# EAGLE design nizal (EAGLE 7.6.0)
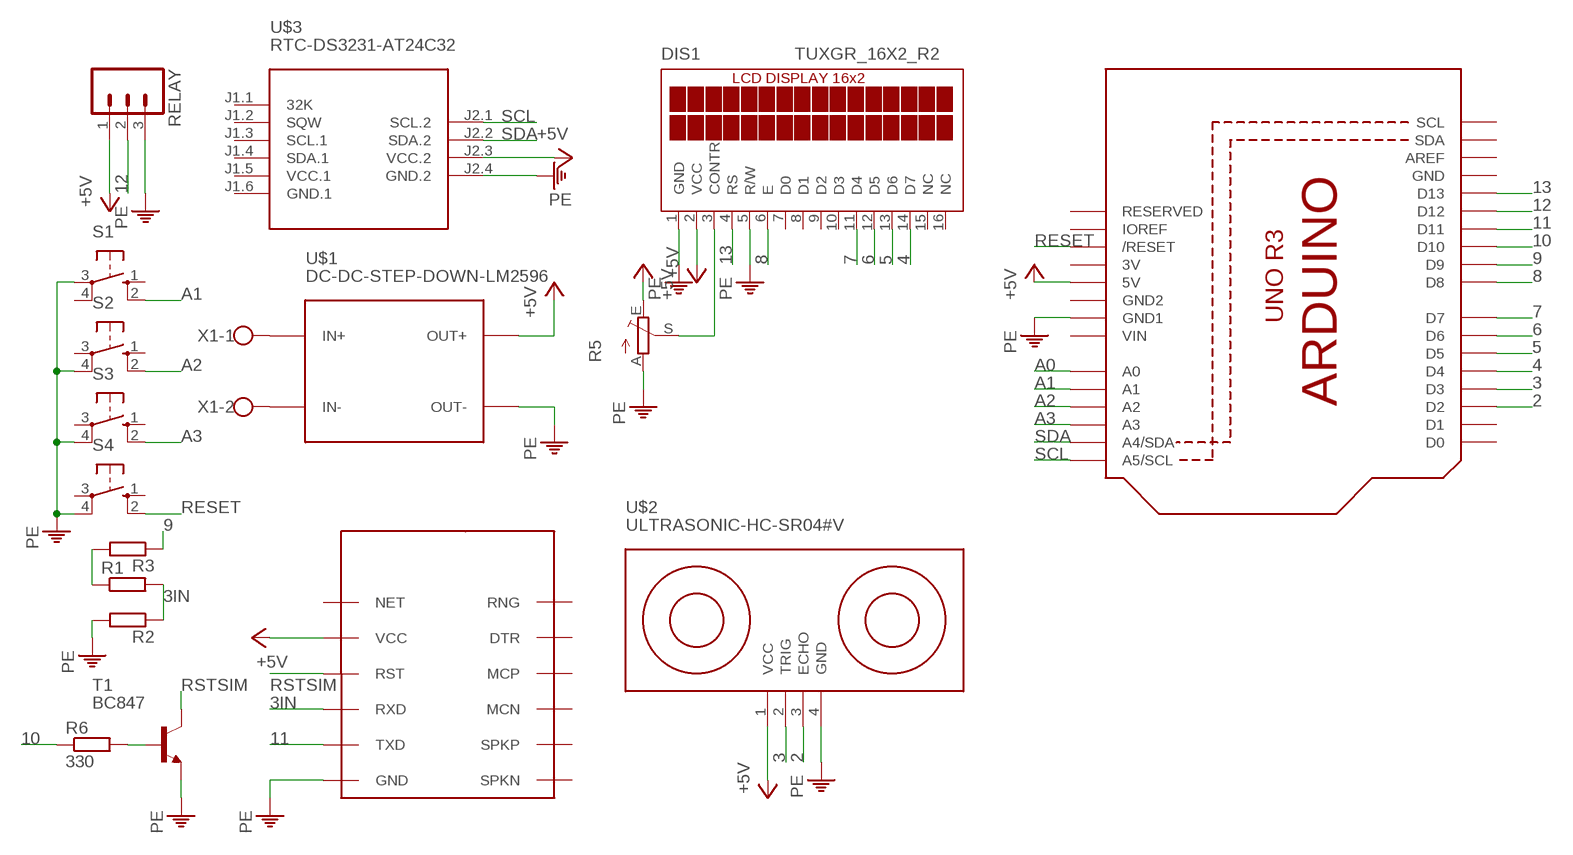
[diagram p0: schematic, sheet 1]

## Parts
DIS1  TUXGR_16X2_R2  [TUXGR_16X2_R2]
R1  R-EU_M0805  [M0805]
R2  R-EU_M0805  [M0805]
R3  R-EU_M0805  [M0805]
R5  TRIM_EU-CA6V  [CA6V]
R6  330  R-EU_M0805  [M0805]
RELAY  M03  [03P]
S1  10-XX  [B3F-10XX]
S2  10-XX  [B3F-10XX]
S3  10-XX  [B3F-10XX]
S4  10-XX  [B3F-10XX]
T1  BC847  [SOT23]
U1  ARDUINOR3-DIMENSION  [ARDUINOR3]
U$1  DC-DC-STEP-DOWN-LM2596  [DC-DC-STEP-DOWN-LM2596]
U$2  ULTRASONIC-HC-SR04#V  [ULTRASONIC-HC-SR04#V]
U$3  RTC-DS3231-AT24C32  [RTC-DS3231-AT24C32]
U$4  SIM800L  [SIM-CORE]
X1  W237-102  [W237-102]

## Nets
2: U1.D2 U$2.3(ECHO)
3: U1.D3 U$2.2(TRIG)
3IN: R1.2 R2.1 U$4.RXD
4: DIS1.14(D7) U1.D4
5: DIS1.13(D6) U1.D5
6: DIS1.12(D5) U1.D6
7: DIS1.11(D4) U1.D7
8: DIS1.6(E) U1.D8
9: R3.1 U1.D9
10: R6.1 U1.D10
11: U1.D11 U$4.TXD
12: RELAY.2 U1.D12
13: DIS1.4(RS) U1.D13
+5V: DIS1.2(VCC) R5.E RELAY.1 U1.5V U$1.OUT+ U$2.1(VCC) U$3.J2.3(VCC.2) U$4.VCC
A0: U1.A0
A1: S1.2(S1) U1.A1
A2: S2.2(S1) U1.A2
A3: S3.2(S1) U1.A3
N$1: U$1.IN+ X1.1
N$2: U$1.IN- X1.2
N$4: R6.2 T1.1(B)
N$6: R1.1 R3.2
N$11: DIS1.3(CONTR) R5.S
PE: DIS1.1(GND) DIS1.5(R/W) R2.2 R5.A RELAY.3 S1.3(P) S2.4(P1) S3.4(P1) S4.4(P1) T1.2(E) U1.GND1 U$1.OUT- U$2.4(GND) U$3.J2.4(GND.2) U$4.GND
RESET: S4.2(S1) U1.RESET(/RESET)
RSTSIM: T1.3(C) U$4.RST
SCL: U1.A5(A5/SCL) U$3.J2.1(SCL.2)
SDA: U1.A4(A4/SDA) U$3.J2.2(SDA.2)
Unconnected: DIS1.7(D0) DIS1.8(D1) DIS1.9(D2) DIS1.10(D3) DIS1.15(NC) DIS1.16(NC) S1.1(S) S1.4(P1) S2.1(S) S2.3(P) S3.1(S) S3.3(P) S4.1(S) S4.3(P) U1.AREF U1.D0 U1.D1 U1.IOREF U1.RESERVED U1.SCL U1.SDA U$3.J1.1(32K) U$3.J1.2(SQW) U$3.J1.3(SCL.1) U$3.J1.4(SDA.1) U$4.DTR U$4.MCN U$4.MCP U$4.NET U$4.RNG U$4.SPKN U$4.SPKP

## Power pins joined to a net without a drawn wire
3V: U1.3V
GND: U1.GND
GND2: U1.GND2
GND.1: U$3.J1.6(GND.1)
VCC.1: U$3.J1.5(VCC.1)
VIN: U1.VIN

## Library data of the parts
DIS1 = display-lcd:TUXGR_16X2_R2: Tuxgraphics LCD display 16x2 characters reflective, without background light Source: tuxgr_12x2_r2.pdf; OC_FARNELL: unknown; OC_NEWARK: unknown
R1-R3 R6 = rcl:R-EU_: RESISTOR, European symbol
R5 = pot:TRIM_EU-: POTENTIOMETER
RELAY = con-amp-quick:M03: AMP QUICK CONNECTOR; OC_FARNELL: unknown; OC_NEWARK: unknown
S1-S4 = switch-omron:10-XX: OMRON SWITCH; MPN: B3F-1000; OC_FARNELL: 176432; OC_NEWARK: 36M3542
T1 = transistor:BC847: NPN TRANSISTOR
U1 = microbuilder:ARDUINOR3: This is a new object for the new Arduino R3 - with extra pins that you may want to use (such as IOref, and duplicated A4/A5
U$1 = zmpt:DC-DC-STEP-DOWN-LM2596: DC/DC Step-Down Regulator based on LM2596-ADJ chip LM2596 datasheet available here: http://www.ti.com/lit/ds/symlink/lm2596.pdf Click here to find device on ebay.com <http://www.ebay.com/sch/lm2596+power+regulator>
U$2 = diy-modules:ULTRASONIC-HC-SR04: Ultrasonic Ranging Module HC-SR04 More details available here: http://randomnerdtutorials.com/complete-guide-for-ultrasonic-sensor-hc-sr04/ Click here to find device on ebay.com <http://www.ebay.com/sch/hc+sr04+ultrasonic>
U$3 = diy-modules:RTC-DS3231-AT24C32: RTC Module with Battery and EEPROM based on DS3231 and AT24C32 chips Tutorial can be found here: https://edwardmallon.wordpress.com/2014/05/21/using-a-cheap-3-ds3231-rtc-at24c32-eeprom-from-ebay/ Click here to find device on ebay.com <http://www.ebay.com/sch/DS3231+AT24C32+module>
U$4 = sim800l:SIM800L
X1 = con-wago-500:W237-102: WAGO SCREW CLAMP; MPN: 237-102; OC_FARNELL: unknown; OC_NEWARK: 70K9898

## Net classes
0 default: width 0.457 mm, drill 0.457 mm, clearance 0.457 mm

## Board
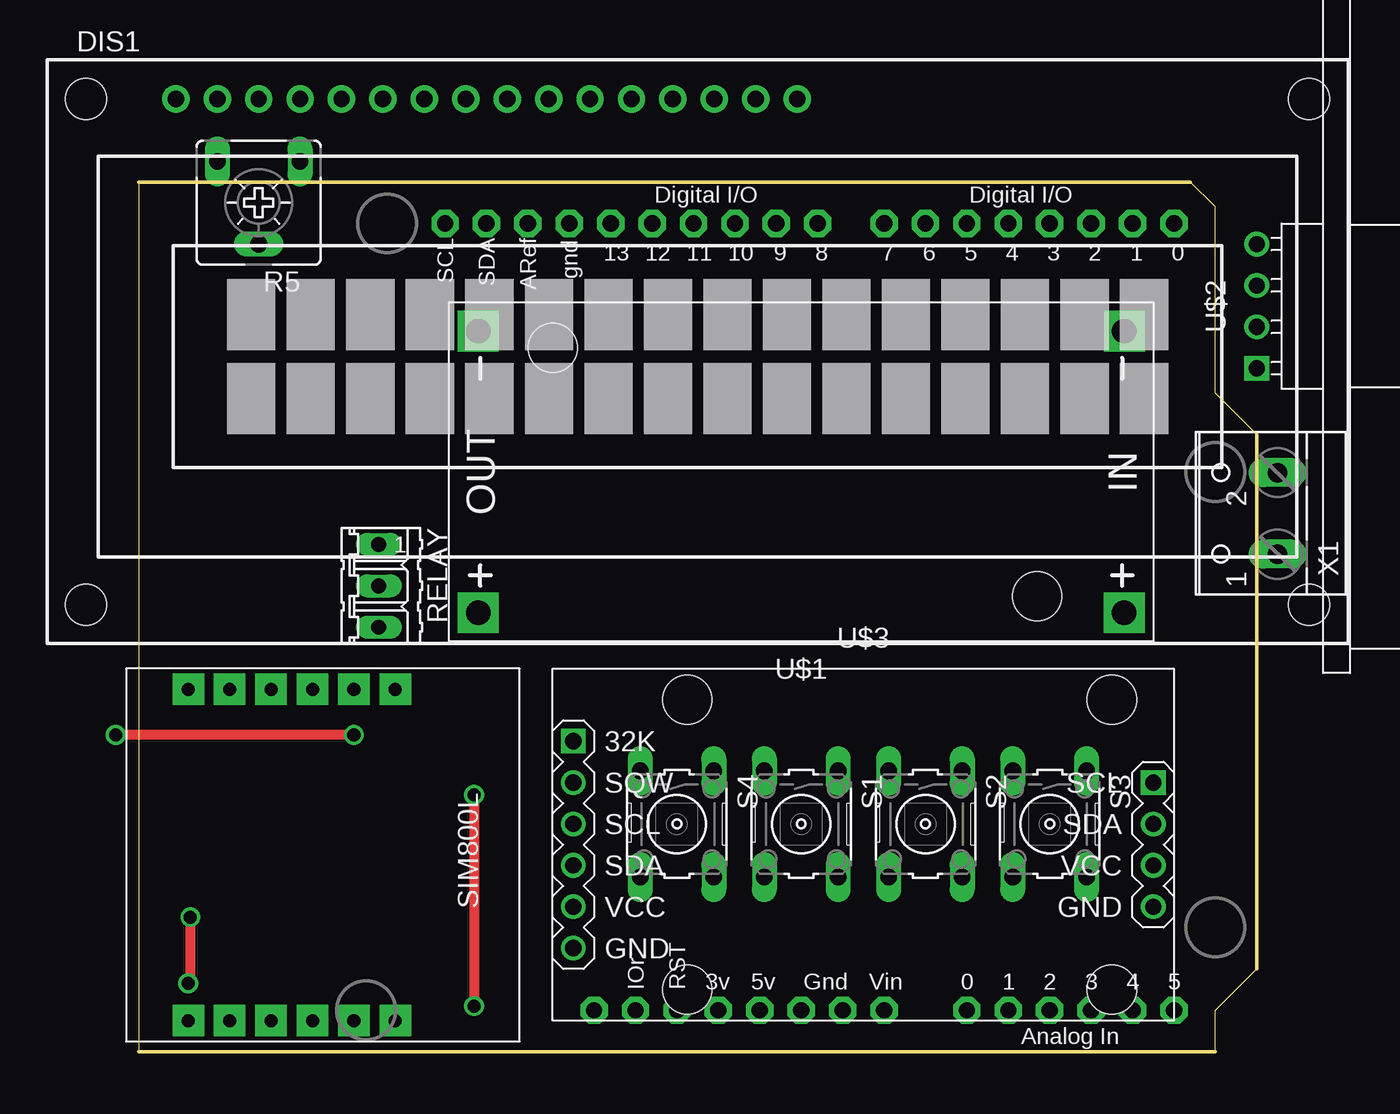
[diagram p1: board, top side]
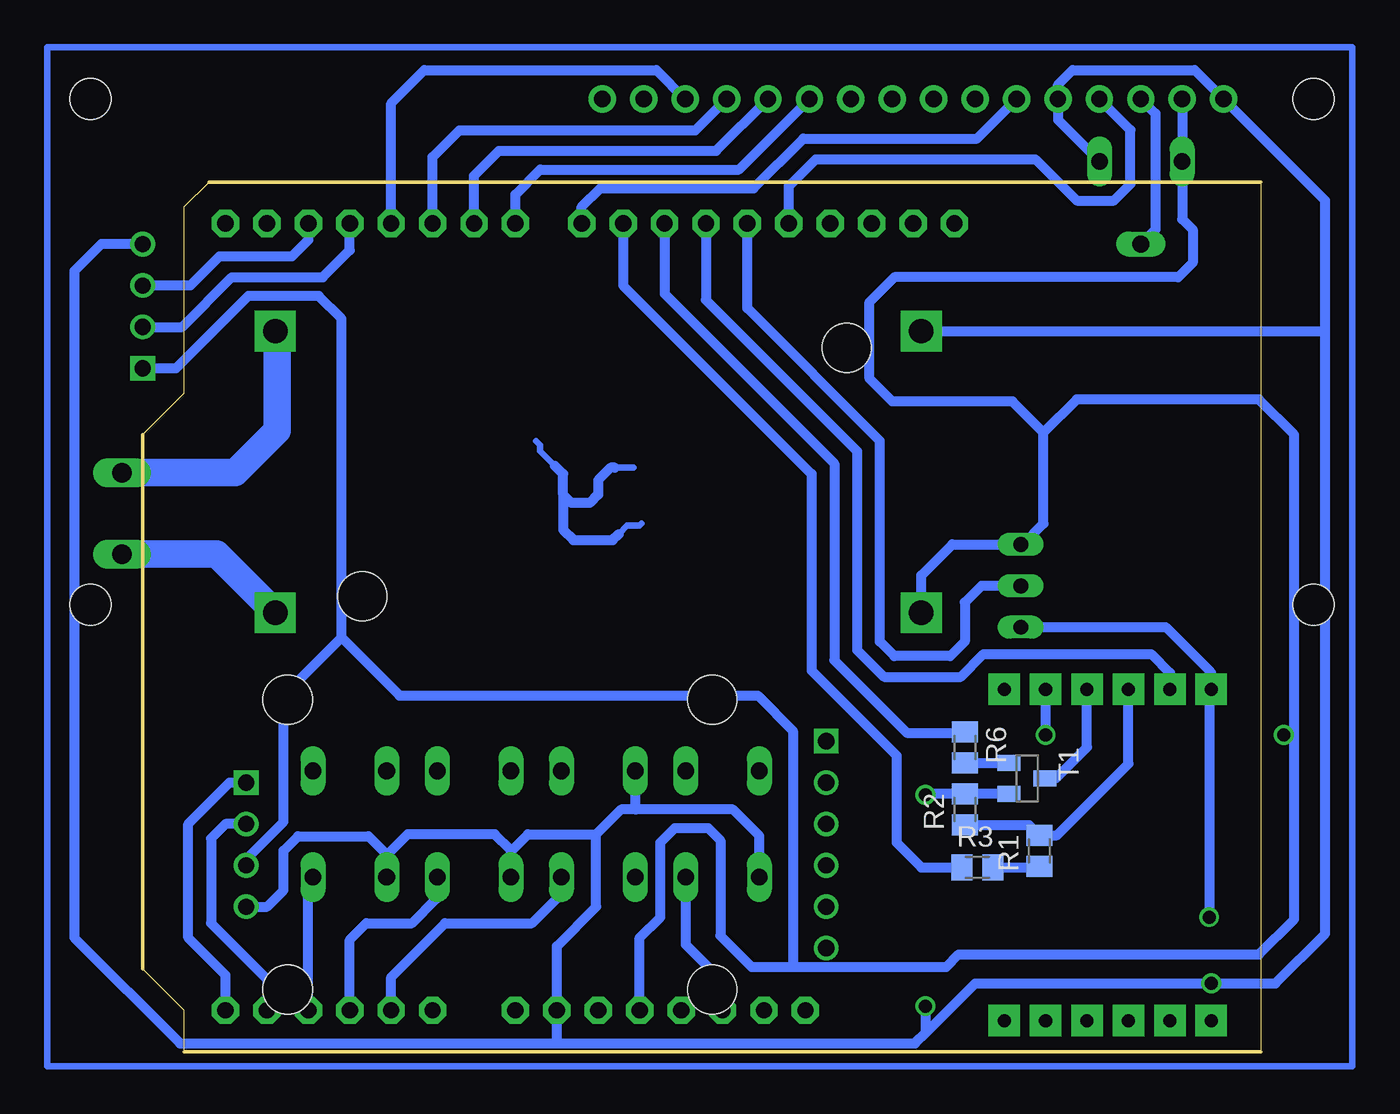
[diagram p2: board, bottom side, seen from below]

Size 68.58 x 53.34 mm. Coordinates in mm from the lower left corner, seen from the top.
Copper layers (1*16): Top 0.035mm / dielectric 1.5mm / Bottom 0.035mm
Design rules "default": minimum track width 10mil, minimum drill 24mil, track to track 8mil, track to pad 8mil, pad to pad 8mil, via to via 8mil, smd to smd 8mil, copper to edge 40mil, drill to drill 8mil, minimum pad ring 10mil, minimum via ring 8mil, stop-mask expansion 4mil, vias tented up to drill 0mil, thermal gap 10mil

### Footprints (pad centres in the part's own frame; a part is rotated, then mirrored left to right if it is on the bottom)
TUXGR_16X2_R2 = drill 1 pad 1.676: 1 -32,15.5; 2 -29.46,15.5; 3 -26.92,15.5; 4 -24.38,15.5; 5 -21.84,15.5; 6 -19.3,15.5; 7 -16.76,15.5; 8 -14.22,15.5; 9 -11.68,15.5; 10 -9.14,15.5; 11 -6.6,15.5; 12 -4.06,15.5; 13 -1.52,15.5; 14 1.02,15.5; 15 3.56,15.5; 16 6.1,15.5 | hole 2.5: -37.5,-15.5; 37.5,-15.5; -37.5,15.5; 37.5,15.5
M0805 = smd 1.3 x 1.6: 1 -0.95,0; 2 0.95,0
CA6V = drill 1.016 long: A -2.54,-2.54; E 2.54,-2.54; S 0,2.54
03P = drill 0.914 long: 1 -2.54,0; 2 0,0; 3 2.54,0
B3F-10XX = drill 1.016 long: 1 -3.251,2.261; 2 3.251,2.261; 3 -3.251,-2.261; 4 3.251,-2.261
SOT23 = smd 1 x 1.4: 1 -0.95,-1.1; 2 0.95,-1.1; 3 0,1.1
ARDUINOR3 = drill 1 pad 1.676 octagon: 3V 35.56,2.54; 5V 38.1,2.54; A0 50.8,2.54; A1 53.34,2.54; A2 55.88,2.54; A3 58.42,2.54; A4 60.96,2.54; A5 63.5,2.54; AREF 23.876,50.8; D0 63.5,50.8; D1 60.96,50.8; D2 58.42,50.8; D3 55.88,50.8; D4 53.34,50.8; D5 50.8,50.8; D6 48.26,50.8; D7 45.72,50.8; D8 41.656,50.8; D9 39.116,50.8; D10 36.576,50.8; D11 34.036,50.8; D12 31.496,50.8; D13 28.956,50.8; GND 26.416,50.8; GND1 43.18,2.54; GND2 40.64,2.54; IOREF 30.48,2.54; RESERVED 27.94,2.54; RESET 33.02,2.54; SCL 18.796,50.8; SDA 21.336,50.8; VIN 45.72,2.54
DC-DC-STEP-DOWN-LM2596 = drill 1.5 pad 2.5 square: IN+ -19.812,8.636; IN- -19.812,-8.636; OUT+ 19.812,8.636; OUT- 19.812,-8.636 | hole 3: -14.478,7.62; 15.24,-7.62
ULTRASONIC-HC-SR04#V = drill 1 square: 1 -3.81,0 | drill 1: 2 -1.27,0; 3 1.27,0; 4 3.81,0
RTC-DS3231-AT24C32 = drill 1 square: J1.1 -17.78,6.35; J2.1 17.78,3.81 | drill 1: J1.2 -17.78,3.81; J1.3 -17.78,1.27; J1.4 -17.78,-1.27; J1.5 -17.78,-3.81; J1.6 -17.78,-6.35; J2.2 17.78,1.27; J2.3 17.78,-1.27; J2.4 17.78,-3.81 | hole 3: -10.795,-8.89; -10.795,8.89; 15.24,8.89; 15.24,-8.89
SIM-CORE = drill 0.8 pad 1.93 square: DTR 21.59,13.97; GND 1.27,3.81; MCN 21.59,8.89; MCP 21.59,11.43; NET 1.27,16.51; RNG 21.59,16.51; RST 1.27,11.43; RXD 1.27,8.89; SPKN 21.59,3.81; SPKP 21.59,6.35; TXD 1.27,6.35; VCC 1.27,13.97
W237-102 = drill 1.194 long: 1 -2.5,-1.27; 2 2.5,-1.27

### Placement (x,y rotation side)
DIS1  34.29,42.93 0 top
R1  13.59,12.32 90 bottom
R2  18.16,14.86 90 bottom
R3  17.4,11.3 0 bottom
R5  7.37,52.07 180 top
R6  18.16,18.67 270 bottom
RELAY  14.73,28.57 270 top
S1  40.64,13.97 270 top
S2  48.26,13.97 270 top
S3  55.88,13.97 270 top
S4  33.02,13.97 270 top
T1  14.35,16.76 270 bottom
U1  0,0 0 top
U$1  40.64,35.56 180 top
U$2  68.58,45.72 90 top
U$3  44.45,12.7 0 top
U$4  -0.76,23.5 270 top
X1  68.58,33.02 90 top

### Tracks (layer width: path | path; a pad name or v marks a point on that pad's centre or on a via)
2
  Bottom 0.61: U1.D2 58.42,49.78 59.44,48.77 63.88,48.77 65.66,46.99 U$2.3
3
  Bottom 0.61: U$2.2 66.17,44.45 63.12,47.5 57.53,47.5 55.88,49.15 U1.D3
3IN
  Bottom 0.61: R2.1 14.23,13.91 R1.2 12.51,13.27 8.13,17.65 U$4.RXD
4
  Bottom 0.61: U1.D4 53.34,58.17 51.31,60.2 37.08,60.2 DIS1.14
5
  Bottom 0.61: U1.D5 50.8,54.86 49.15,56.52 34.68,56.52 DIS1.13
6
  Bottom 0.61: U1.D6 48.26,53.72 46.74,55.24 33.41,55.24 DIS1.12
7
  Bottom 0.61: U1.D7 45.72,52.58 44.2,54.1 32.01,54.1 DIS1.11
8
  Bottom 0.61: U1.D8 41.66,51.82 40.51,52.96 31.11,52.96 28.07,56.01 17.41,56.01 DIS1.6
9
  Bottom 0.61: U1.D9 39.12,46.99 27.56,35.43 27.56,23.37 22.35,18.16 22.35,12.83 20.83,11.3 R3.1
10
  Bottom 0.61: U1.D10 36.58,46.48 26.16,36.07 26.16,24 21.72,19.56 18.22,19.56 R6.1
11
  Bottom 0.61: U1.D11 34.04,46.1 24.77,36.83 24.77,24.64 23.11,22.99 18.41,22.99 17.02,24.38 6.73,24.38 5.59,23.24 U$4.TXD
12
  Bottom 0.61: RELAY.2 17.14,28.57 18.16,27.56 18.16,25.15 19.05,24.26 22.48,24.26 23.37,25.15 23.37,37.47 31.5,45.59 U1.D12
13
  Bottom 0.61: U1.D13 28.96,53.09 27.3,54.74 13.84,54.74 11.3,52.2 9.02,52.2 8,53.21 8,56.52 DIS1.4
+5V  (via drill 0.8)
  Top 0.61: v13.21,19.43 v-1.4,19.43
  Bottom 0.61: U$3.J2.3 62.23,11.81 59.94,14.1 59.94,21.84 56.39,25.4 | 56.39,25.4 56.39,44.96 57.78,46.36 62.1,46.36 66.55,41.91 U$2.1 | DIS1.2 R5.E 4.83,51.05 4.19,50.42 4.19,48.39 5.08,47.5 22.48,47.5 24,45.97 24,41.27 22.61,39.88 15.24,39.88 13.34,37.97 | U$1.OUT+ 20.83,29.21 18.92,31.11 RELAY.1 14.61,31.11 13.34,32.39 13.34,37.97 | U1.5V 38.1,6.98 36.83,8.25 36.83,12.83 35.94,13.72 33.91,13.72 33.15,12.95 33.15,7.11 31.24,5.21 28.7,5.21 | 28.7,5.21 19.3,5.21 18.54,5.97 0.13,5.97 -2.03,8.13 -2.03,19.3 | -2.03,19.3 -2.03,37.85 0.13,40 11.3,40 13.34,37.97 | 56.39,25.4 52.83,21.84 30.86,21.84 28.7,19.68 28.7,5.21 | U$4.VCC v13.21,19.43 | v-1.4,19.43 -1.91,19.43 -2.03,19.3
A1
  Bottom 0.61: U1.A1 53.34,4.57 50.04,7.87 44.7,7.87 42.93,9.65 42.93,10.69 S1.2
A2
  Bottom 0.61: U1.A2 55.88,6.86 54.86,7.87 52.07,7.87 50.55,9.4 50.55,10.69 S2.2
A3
  Bottom 0.61: U1.A3 58.42,10.44 S3.2
N$1
  Bottom 1.676: X1.1 64.05,30.52 U$1.IN+
N$2
  Bottom 1.676: X1.2 62.91,35.52 60.33,38.1 60.33,44.07 U$1.IN-
N$3
  Bottom 0.406: 38.48,35.81 39.62,35.81 | 43.31,35.94 44.2,36.83 44.2,37.21 44.45,37.47 | 39.37,31.75 38.86,32.26 38.1,32.26 37.97,32.39
  Bottom 0.61: 39.62,35.81 39.88,35.81 40.64,35.05 40.64,34.16 41.15,33.66 42.29,33.66 42.8,34.16 | 42.8,34.16 42.8,35.43 43.31,35.94 | 42.8,34.16 42.8,32 42.16,31.37 39.75,31.37 39.37,31.75
N$4
  Bottom 0.61: R6.2 T1.1
N$5
  Bottom 0.406: -5.59,61.59 74.42,61.59 74.42,-0.89 -5.59,-0.89 -5.59,61.59
N$6
  Bottom 0.61: R3.2 13.66,11.3 R1.1
N$11
  Bottom 0.61: DIS1.3 6.48,57.53 6.48,50.42 R5.S
PE  (via drill 0.8)
  Top 0.61: v20.57,15.75 v20.57,2.79 | v3.18,8.25 3.18,4.32 v3.05,4.19
  Bottom 0.61: U$3.J2.4 60.96,8.89 59.94,9.91 59.94,12.32 59.05,13.21 54.74,13.21 53.59,12.06 | 53.59,12.06 53.59,10.74 S3.4 | 40.77,13.33 44.96,13.33 46,12.29 S2.4 46,12.34 46.99,13.33 52.32,13.33 53.59,12.06 | T1.2 R2.2 20.51,15.81 v20.57,15.75 | 40.77,13.33 40.77,8.89 43.18,6.48 U1.GND1 43.18,0.51 | R5.A 12.45,57.15 DIS1.5 12.45,59.3 11.56,60.2 4.06,60.2 DIS1.1 -3.94,52.2 -3.94,44.2 | U$4.GND 3.05,23.24 3.18,23.37 | U$2.4 71.12,49.53 72.77,47.88 72.77,6.98 66.29,0.51 43.18,0.51 | 43.18,0.51 21.21,0.51 20.51,1.21 | 20.51,1.21 17.53,4.19 v3.05,4.19 1.91,4.19 -0.89,4.19 -3.94,7.24 -3.94,44.2 | U$1.OUT- -3.94,44.2 | S4.4 30.76,13.23 32.38,14.86 38.35,14.86 | 38.35,14.86 39.24,14.86 40.77,13.33 | S1.3 38.38,14.88 38.35,14.86 | v20.57,2.79 20.57,1.27 20.51,1.21 | RELAY.3 5.84,26.04 3.18,23.37 | 3.18,23.37 v3.18,8.25
RESET
  Bottom 0.61: S4.2 35.28,6.58 33.02,4.32 U1.RESET
RSTSIM
  Bottom 0.61: T1.3 12.57,16.76 10.67,18.67 U$4.RST
SCL
  Bottom 0.61: U1.A5 63.5,4.7 65.79,6.98 65.79,13.97 63.25,16.51 U$3.J2.1
SDA
  Bottom 0.61: U$3.J2.2 63.5,13.97 64.39,13.08 64.39,7.87 60.96,4.44 U1.A4